# EAGLE design FanControl_1-0 (EAGLE 6.5.0)
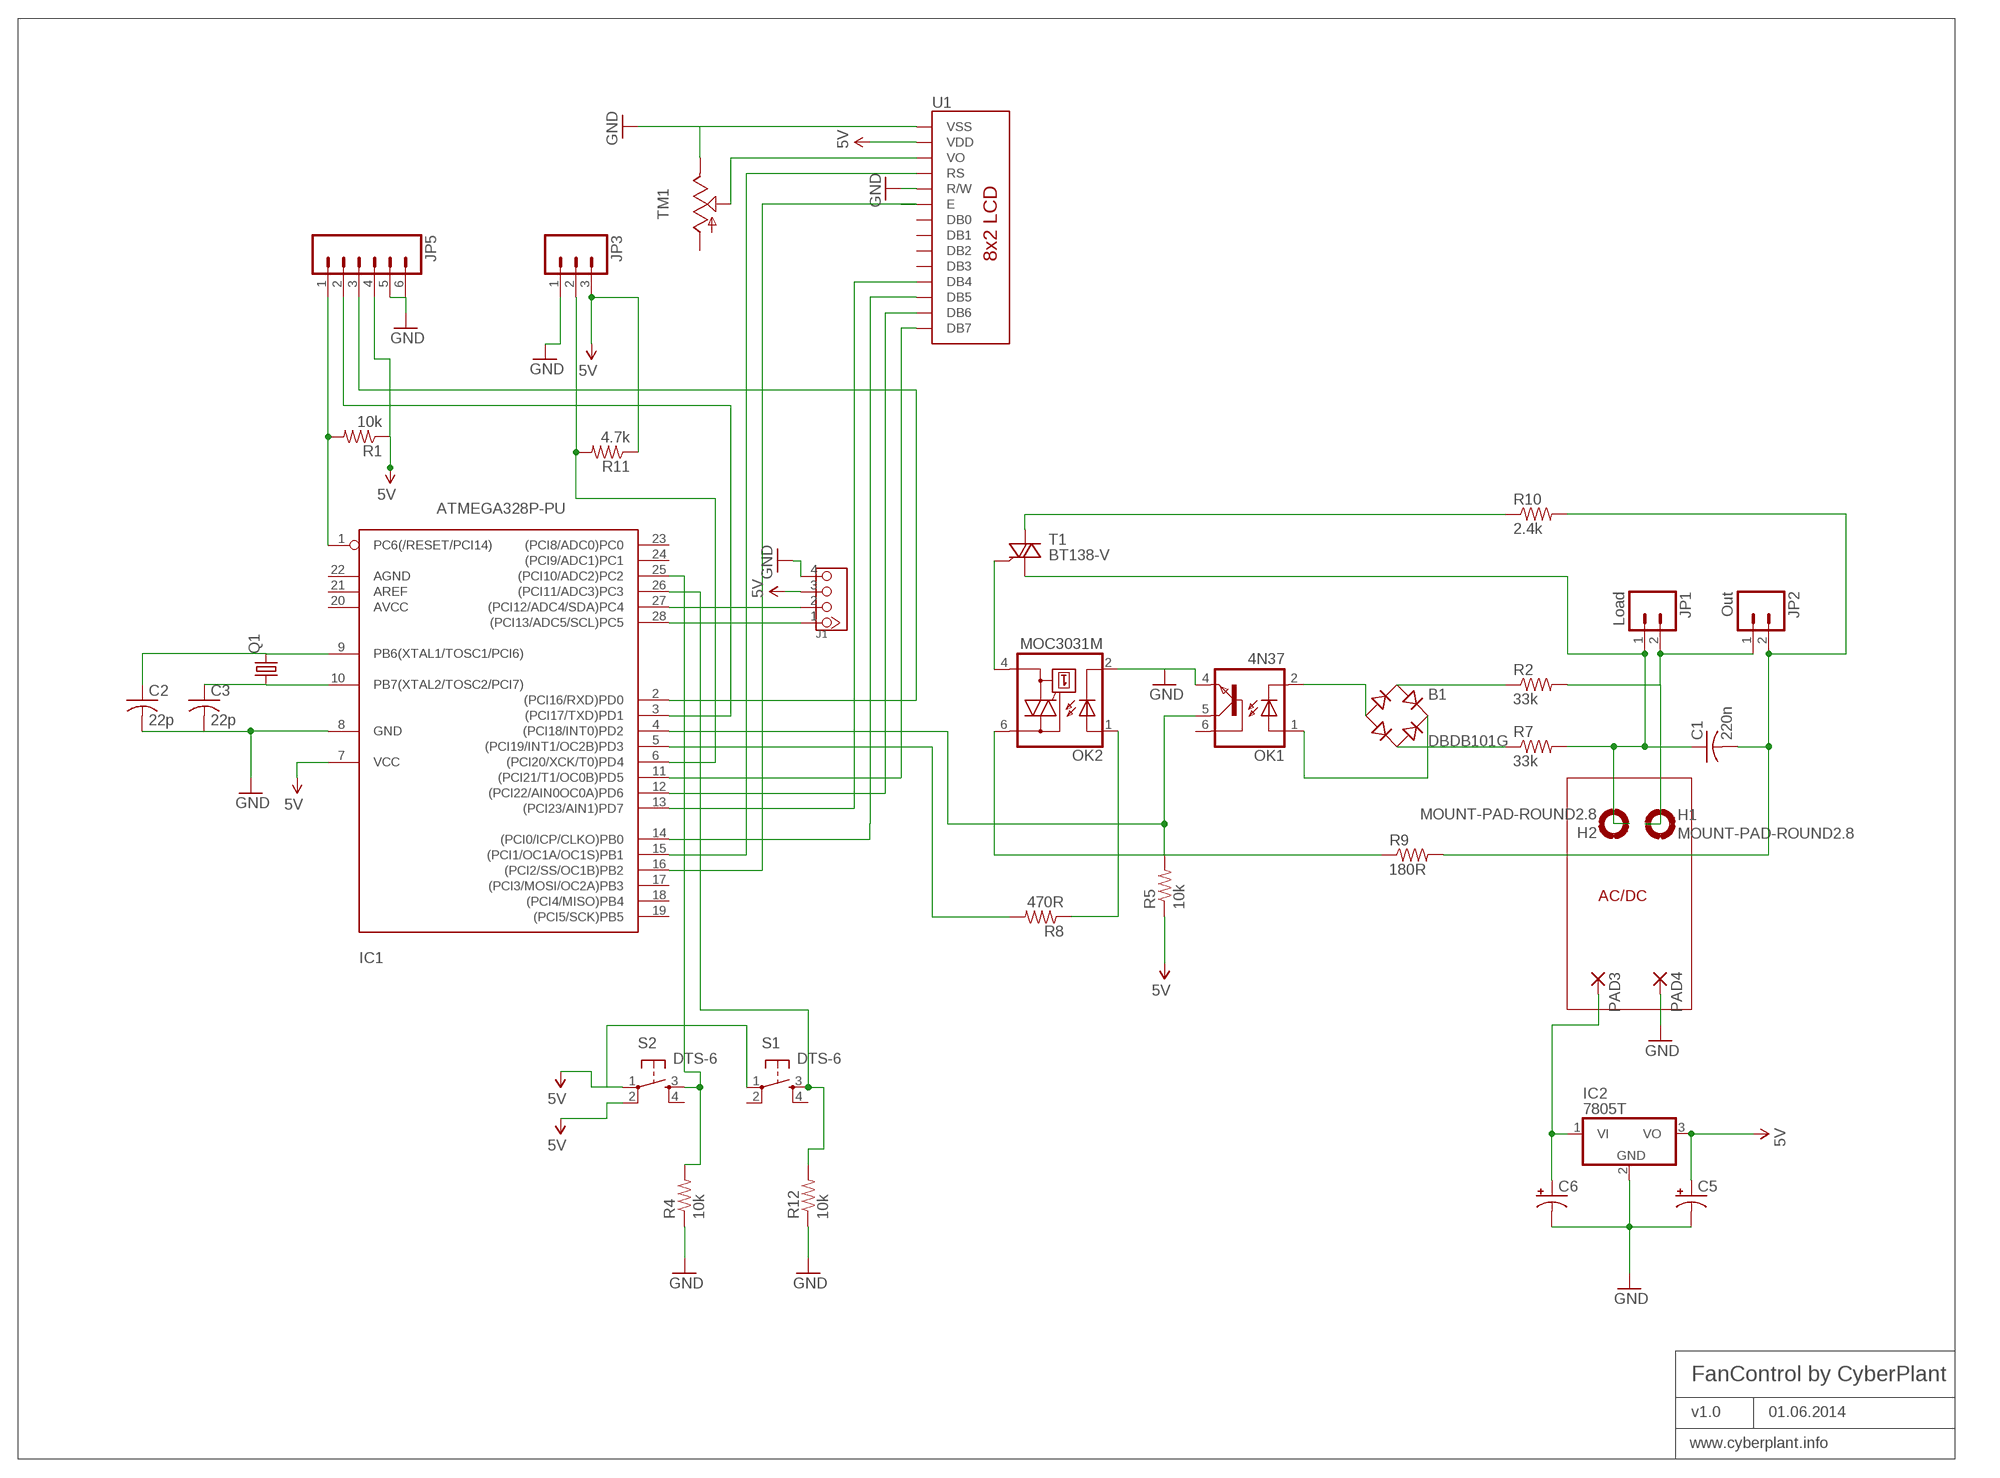
[diagram p0: schematic, sheet 1]

## Parts
B1  DBDB101G  [DB]
C1  220n  C-US150-064X183  [C150-064X183]
C2  22p  C-US050-025X075  [C050-025X075]
C3  22p  C-US050-025X075  [C050-025X075]
C5  CAP_POLPTH2  [CPOL-RADIAL-10UF-25V]
C6  CAP_POLPTH2  [CPOL-RADIAL-10UF-25V]
H1  MOUNT-PAD-ROUND2.8  [2,8-PAD]
H2  MOUNT-PAD-ROUND2.8  [2,8-PAD]
IC1  ATMEGA328P-PU  ATMEGA168-20P  [DIL28-3]
IC2  7805T  [TO220H]
J1  TWIG-4P-2.090D  [4P-2.0-90D]
JP1  Load  M025MM  [SCREWTERMINAL-5MM-2]
JP2  Out  M025MM  [SCREWTERMINAL-5MM-2]
JP3  M031X03_NO_SILK  [1X03_NO_SILK]
JP5  M06SIP  [1X06]
OK1  4N37  [DIL06]
OK2  MOC3031M  [DIL06]
PAD3  1,6/0,8  [1,6/0,8]
PAD4  1,6/0,8  [1,6/0,8]
Q1  CRYSTALHC49S  [HC49/S]
R1  10k  RESISTORPTH-1/6W  [1/6W-RES]
R2  33k  RESISTORPTH-1W  [AXIAL-0.6]
R4  10k  RESISTORPTH-1/6W  [1/6W-RES]
R5  10k  RESISTORPTH-1/6W  [1/6W-RES]
R7  33k  RESISTORPTH-1W  [AXIAL-0.6]
R8  470R  RESISTORPTH-1/4W  [AXIAL-0.4]
R9  180R  RESISTORPTH-2W  [AXIAL-0.8]
R10  2.4k  RESISTORPTH-2W  [AXIAL-0.8]
R11  4.7k  RESISTORPTH-1/4W  [AXIAL-0.4]
R12  10k  RESISTORPTH-1/6W  [1/6W-RES]
S1  DTS-6  [DTS-6]
S2  DTS-6  [DTS-6]
T1  BT138-V  [TO220BV]
TM1  TRIM  [6MM]
U1  LCD-8X2-WH0802A8X2  [LCD-8X2-WH0802A]

## Nets
5V: C5.1(+) IC1.7(VCC) IC2.3(VO) J1.3 JP3.3 JP5.4 R1.1 R5.1 R11.P$1 S1.1 S2.1 S2.2 U1.2(VDD)
GND: C2.2 C3.2 C5.2(-) C6.2(-) IC1.8(GND) IC2.2(GND) J1.4 JP3.1 JP5.5 JP5.6 OK1.4(EMI) OK2.2(C) PAD4.1(P) R4.1 R12.1 TM1.E U1.1(VSS) U1.5(R/W)
N$1: C1.1 H2.B2,8(MOUNT) JP1.1 R7.P$2 T1.T1(A1)
N$2: C1.2 JP2.2 R9.P$2 R10.P$2
N$3: H1.B2,8(MOUNT) JP1.2 JP2.1 R2.P$2
N$4: B1.AC1 R2.P$1
N$5: B1.AC2 R7.P$1
N$6: B1.- OK1.2(C)
N$7: B1.+ OK1.1(A)
N$8: IC1.4((PCI18/INT0)PD2) OK1.5(COL) R5.2
N$9: OK2.4(A1) T1.G
N$10: IC1.5((PCI19/INT1/OC2B)PD3) R8.P$2
N$11: OK2.1(A) R8.P$1
N$12: R10.P$1 T1.T2(A2)
N$13: OK2.6(A2) R9.P$1
N$14: C2.1 IC1.9(PB6(XTAL1/TOSC1/PCI6)) Q1.2
N$15: C3.1 IC1.10(PB7(XTAL2/TOSC2/PCI7)) Q1.1
N$16: IC1.6((PCI20/XCK/T0)PD4) JP3.2 R11.P$2
N$17: C6.1(+) IC2.1(VI) PAD3.1(P)
N$18: TM1.S U1.3(VO)
N$19: IC1.15((PCI1/OC1A/OC1S)PB1) U1.4(RS)
N$20: IC1.16((PCI2/SS/OC1B)PB2) U1.6(E)
N$21: IC1.13((PCI23/AIN1)PD7) U1.11(DB4)
N$22: IC1.14((PCI0/ICP/CLKO)PB0) U1.12(DB5)
N$23: IC1.12((PCI22/AIN0OC0A)PD6) U1.13(DB6)
N$24: IC1.11((PCI21/T1/OC0B)PD5) U1.14(DB7)
N$26: IC1.25((PCI10/ADC2)PC2) R4.2 S2.3
N$27: IC1.26((PCI11/ADC3)PC3) R12.2 S1.3
N$28: IC1.28((PCI13/ADC5/SCL)PC5) J1.1
N$29: IC1.1(PC6(/RESET/PCI14)) JP5.1 R1.2
N$30: IC1.27((PCI12/ADC4/SDA)PC4) J1.2
N$31: IC1.3((PCI17/TXD)PD1) JP5.2
N$32: IC1.2((PCI16/RXD)PD0) JP5.3
Unconnected: IC1.17((PCI3/MOSI/OC2A)PB3) IC1.18((PCI4/MISO)PB4) IC1.19((PCI5/SCK)PB5) IC1.20(AVCC) IC1.21(AREF) IC1.22(AGND) IC1.23((PCI8/ADC0)PC0) IC1.24((PCI9/ADC1)PC1) OK1.6(BAS) S1.2 S1.4 S2.4 TM1.A U1.7(DB0) U1.8(DB1) U1.9(DB2) U1.10(DB3)

## Notes on the sheet
- AC/DC
- FanControl by CyberPlant
- v1.0 | 01.06.2014
- www.cyberplant.info

## Library data of the parts
B1 = rectifier:DB?*G: Single Phase 1.0 AMP Glass Passivated Bridge Rectifier Taiwan Semiconductor Co.,Ltd. - TSC Source: http://www.taiwansemi.com/TSCbig5/ezcatfiles/cust/img/img/db101g.pdf http://www.ts.com.tw/db/pictures/modules/PDT/PDT060207001/DBLS201G.pdf
C1-C3 = adafruit:C-US: CAPACITOR, American symbol
C5 C6 = wh0802a2:CAP_POL: Capacitor Polarized These are standard SMD and PTH capacitors. Normally 10uF, 47uF, and 100uF in electrolytic and tantalum varieties. Always verify the external diameter of the through hole cap, it varies with capacity, voltage, and manufacturer. The EIA devices should be standard.
H1 H2 = holes:MOUNT-PAD-ROUND: MOUNTING PAD, round
IC1 = adafruit:ATMEGA168*P: MICROCONTROLLER 16 kBytes FLASH 1 kBytes SRAM 512 Bytes EEPROM USART 8-channel 10 bit ADC
IC2 = linear:78*: Positive VOLTAGE REGULATOR Source: http://cache.national.com/ds/LM/LM78L05.pdf http://www.fairchildsemi.com/ds/LM/LM7805.pdf
J1 = Connector:TWIG-4P-2.0
JP1 JP2 = SparkFun:M02: Header 2 Standard 2-pin 0.1" header. Use with straight break away headers (SKU : PRT-00116), right angle break away headers (PRT-00553), swiss pins (PRT-00743), machine pins (PRT-00117), and female headers (PRT-00115). Molex polarized connector foot print use with SKU : PRT-08233 with associated crimp pins and housings.
JP3 = SparkFun:M03: Header 3 Standard 3-pin 0.1" header. Use with straight break away headers (SKU : PRT-00116), right angle break away headers (PRT-00553), swiss pins (PRT-00743), machine pins (PRT-00117), and female headers (PRT-00115). Molex polarized connector foot print use with SKU : PRT-08232 with associated crimp pins and housings.
JP5 = SparkFun:M06: Header 6 Standard 6-pin 0.1" header. Use with straight break away headers (SKU : PRT-00116), right angle break away headers (PRT-00553), swiss pins (PRT-00743), machine pins (PRT-00117), and female headers (PRT-00115). Molex polarized connector foot print use with SKU : PRT-08094 with associated crimp pins and housings. NOTES ON THE VARIANTS LOCK and LOCK_LONGPADS... This footprint was designed to help hold the alignment of a through-hole component (i.e. 6-pin header) while soldering it into place. You may notice that each hole has been shifted either up or down by 0.005 of an inch from it's more standard position (which is a perfectly straight line). This slight alteration caused the pins (the squares in the middle) to touch the edges of the holes. Because they are alternating, it causes a "brace" to hold the component in place. 0.005 has proven to be the perfect amount of "off-center" position when using our standard breakaway headers. Although looks a little odd when you look at the bare footprint, once you have a header in there, the alteration is very hard to notice. Also, if you push a header all the way into place, it is covered up entirely on the bottom side. This idea of altering the position of holes to aid alignment will be further integrated into the Sparkfun Library for other footprints. It can help hold any component with 3 or more connection pins.
OK1 = optocoupler:4N37: OPTO COUPLER Source: http://www.fairchildsemi.com/pf/4N/4N35-M.html; MF: FAIRCHILD SEMICONDUCTOR; MPN: 4N37; OC_FARNELL: 1612456; OC_NEWARK: 72K9948
OK2 = optocoupler:MOC30*: 6-Pin DIP Zero-Cross Optoisolators Triac Driver Output (250/400 Volt Peak) Source: Data sheet <http://www.fairchildsemi.com/ds/MO/MOC3031M.pdf> The old path of data sheet not more available 2013-05-06.; MF: FAIRCHILD SEMICONDUCTOR; MPN: MOC3031M; OC_FARNELL: 9875964; OC_NEWARK: 78K6089
PAD3 PAD4 = wirepad:1,6/0,8: THROUGH-HOLE PAD
Q1 = adafruit:CRYSTAL: CRYSTAL; OC_FARNELL: 1667008; OC_NEWARK: unknown
R1 R2 R4 R5 R7-R12 = SparkFun:RESISTOR: Resistor Basic schematic elements and footprints for 0603, 1206, and PTH resistors.
S1 S2 = switch-tact:DTS-6
T1 = triac:BT138: TRIAC Source: http://www.semiconductors.philips.com BT138_SERIES_2.pdf
TM1 = adafruit:TRIM
U1 = wh0802a2:LCD-8X2-WH0802A

## Board
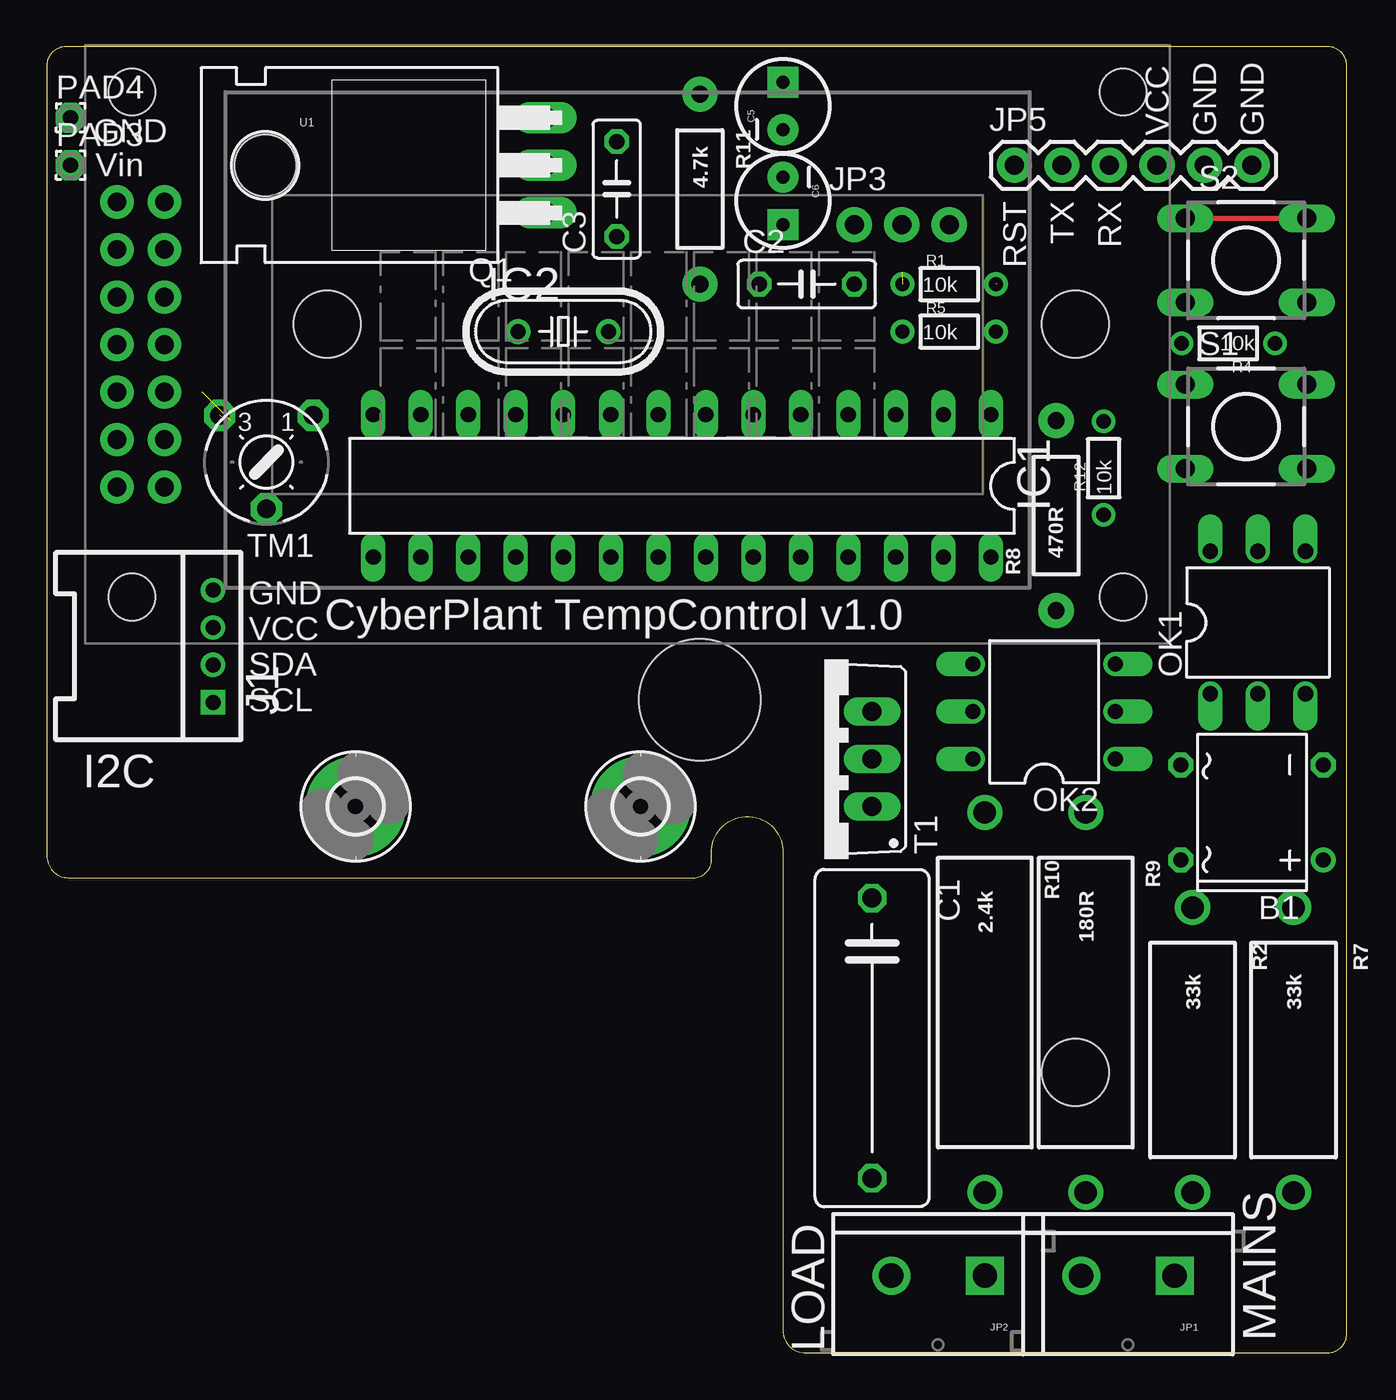
[diagram p1: board, top side]
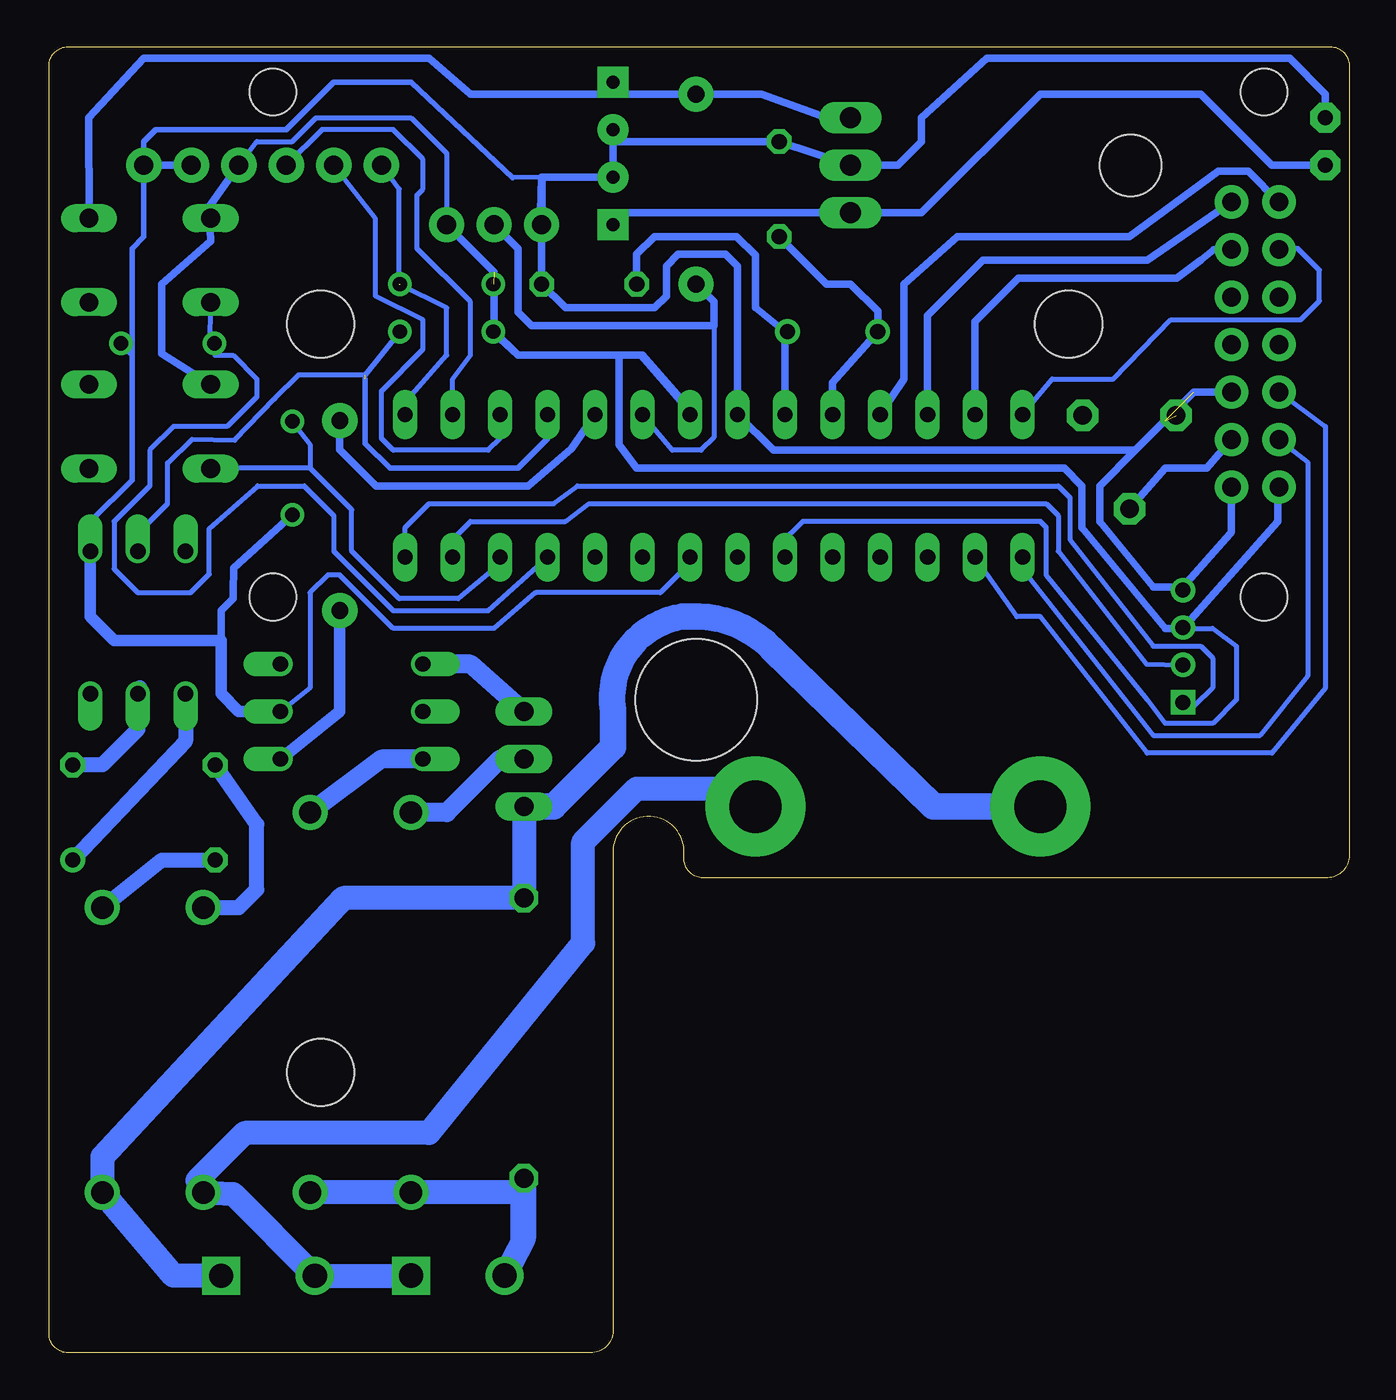
[diagram p2: board, bottom side, seen from below]

Size 69.52 x 69.84 mm. Coordinates in mm from the lower left corner, seen from the top.
Outline: 1.27,25.4 34.56,25.4 arc90 35.56,26.4 35.56,26.67 arc-186 39.37,26.67 39.37,1.27 arc90 40.46,0 68.52,0 arc90 69.52,1 69.52,68.84 arc90 68.52,69.84 1,69.84 arc90 0,68.84 0,26.49 arc90 1.27,25.4
Copper layers (1*16): Top 0.035mm / dielectric 1.5mm / Bottom 0.035mm
Design rules "default": minimum track width 10mil, minimum drill 24mil, track to track 8mil, track to pad 8mil, pad to pad 8mil, via to via 8mil, smd to smd 8mil, copper to edge 40mil, drill to drill 8mil, minimum pad ring 10mil, minimum via ring 8mil, stop-mask expansion 4mil, vias tented up to drill 0mil, thermal gap 10mil
Holes 6.5 mm at 34.92,34.92
Holes 3.6 mm at 15,55 55,15 55,55

### Footprints (pad centres in the part's own frame; a part is rotated, then mirrored left to right if it is on the bottom)
DB = drill 0.813: + -2.54,-3.81 | drill 0.813 octagon: - 2.54,-3.81; AC1 2.54,3.81; AC2 -2.54,3.81
C150-064X183 = drill 1.016 octagon: 1 -7.493,0; 2 7.493,0
C050-025X075 = drill 0.813 octagon: 1 -2.54,0; 2 2.54,0
CPOL-RADIAL-10UF-25V = drill 0.7 pad 1.651 square: 1 1.27,0 | drill 0.7 pad 1.651: 2 -1.27,0
2,8-PAD = drill 2.8 pad 5.334: B2,8 0,0
DIL28-3 = drill 0.813 long: 1 -16.51,-3.81; 2 -13.97,-3.81; 3 -11.43,-3.81; 4 -8.89,-3.81; 5 -6.35,-3.81; 6 -3.81,-3.81; 7 -1.27,-3.81; 8 1.27,-3.81; 9 3.81,-3.81; 10 6.35,-3.81; 11 8.89,-3.81; 12 11.43,-3.81; 13 13.97,-3.81; 14 16.51,-3.81; 15 16.51,3.81; 16 13.97,3.81; 17 11.43,3.81; 18 8.89,3.81; 19 6.35,3.81; 20 3.81,3.81; 21 1.27,3.81; 22 -1.27,3.81; 23 -3.81,3.81; 24 -6.35,3.81; 25 -8.89,3.81; 26 -11.43,3.81; 27 -13.97,3.81; 28 -16.51,3.81
TO220H = drill 1.118 long: 1 -2.54,-10.16; 2 0,-10.16; 3 2.54,-10.16 | hole 3.302: 0,4.826
4P-2.0-90D = drill 0.8 pad 1.27 square: 1 -3,0 | drill 0.8 pad 1.27: 2 -1,0; 3 1,0; 4 3,0
SCREWTERMINAL-5MM-2 = drill 1.3 pad 2.032 square: 1 0,0 | drill 1.3 pad 2.032: 2 5,0
1X03_NO_SILK = drill 1.016 pad 1.88: 1 0,0; 2 2.54,0; 3 5.08,0
1X06 = drill 1.016 pad 1.88: 1 0,0; 2 2.54,0; 3 5.08,0; 4 7.62,0; 5 10.16,0; 6 12.7,0
DIL06 = drill 0.813 offset: 1 -2.54,-3.81; 2 0,-3.81; 3 2.54,-3.81; 4 2.54,3.81; 5 0,3.81; 6 -2.54,3.81
1,6/0,8 = drill 0.813 pad 1.6 octagon: 1 0,0
HC49/S = drill 0.813: 1 -2.413,0; 2 2.413,0
1/6W-RES = drill 0.762: 1 -2.5,0; 2 2.5,0
AXIAL-0.6 = drill 1.2 pad 1.88: P$1 -7.62,0; P$2 7.62,0
AXIAL-0.4 = drill 0.9 pad 1.88: P$1 -5.08,0; P$2 5.08,0
AXIAL-0.8 = drill 1.2 pad 1.88: P$1 -10.16,0; P$2 10.16,0
DTS-6 = drill 1 long: 1 -3.25,2.25; 2 3.25,2.25; 3 -3.25,-2.25; 4 3.25,-2.25
TO220BV = drill 1.016 long: G 2.54,-2.54; T1 -2.54,-2.54; T2 0,-2.54
6MM = drill 1 pad 1.676 octagon: A -2.5,-2.5; E 2.5,-2.5; S 0,2.5
LCD-8X2-WH0802A = drill 1 pad 1.778: 1 -26.26,-9.12; 2 -28.8,-9.12; 3 -26.26,-6.58; 4 -28.8,-6.58; 5 -26.26,-4.04; 6 -28.8,-4.04; 7 -26.26,-1.5; 8 -28.8,-1.5; 9 -26.26,1.04; 10 -28.8,1.04; 11 -26.26,3.58; 12 -28.8,3.58; 13 -26.26,6.12; 14 -28.8,6.12 | hole 2.5: 25,-15; 25,12; -28,12; -28,-15

### Placement (x,y rotation side)
B1  64.45,28.89 90 top
C1  44.13,16.83 270 top
C2  40.64,57.15 0 top
C3  30.48,62.23 90 top
C5  39.37,66.67 90 top
C6  39.37,61.59 270 top
H1  31.75,29.21 0 top
H2  16.51,29.21 0 top
IC1  33.97,46.35 180 top
IC2  16.51,63.5 90 top
J1  8.89,37.78 90 top
JP1  60.31,4.12 180 top
JP2  50.16,4.13 180 top
JP3  43.18,60.33 0 top
JP5  51.75,63.5 0 top
OK1  64.77,39.05 0 top
OK2  53.34,34.29 90 top
PAD3  1.27,63.5 0 top
PAD4  1.27,66.04 0 top
Q1  27.62,54.61 0 top
R1  48.26,57.15 0 top
R2  61.28,16.19 270 top
R4  63.18,53.98 180 top
R5  48.26,54.61 0 top
R7  66.67,16.19 270 top
R8  53.98,44.77 90 top
R9  55.56,18.73 270 top
R10  50.16,18.73 270 top
R11  34.92,62.23 270 top
R12  56.52,47.31 90 top
S1  64.14,49.53 0 top
S2  64.14,58.42 0 top
T1  41.59,31.75 90 top
TM1  11.75,47.62 180 top
U1  32.55,55.41 0 top

### Tracks (layer width: path | path; a pad name or v marks a point on that pad's centre or on a via)
5V  (1 unrouted)
  Top 0.254: S2.1 S2.2
  Bottom 0.254: 35.56,50.8 IC1.7 | 3.81,45.72 U1.2 | 44.45,53.34 R5.1 | J1.3 8.89,38.73 | JP3.3 48.26,64.14 50.16,66.04 55.24,66.04 56.52,64.77 58.42,64.77 JP5.4 60.88,61.35 S2.1 60.88,59.45
  Bottom 0.406: R11.P$1 31.43,67.31 27.94,66.04 IC2.3 | 45.72,54.61 44.45,53.34 | JP3.3 45.72,57.78 45.72,54.61 | 35.56,50.8 37.78,53.34 37.88,53.34 | R11.P$1 46.99,67.31 49.21,69.22 64.45,69.22 67.41,66.04 S2.2 | 39.05,53.34 37.88,53.34 | 37.88,53.34 35.56,50.7 IC1.7 | 45.72,54.61 45.72,54.52 44.45,53.34 | 44.45,53.34 39.05,53.34 | 39.05,53.34 39.05,48.58 38.1,47.31 15.24,47.31 14.29,46.35 14.29,44.13 9.84,38.73 8.89,38.73 3.81,44.45 3.81,45.72 | R11.P$1 39.37,67.31 C5.1 | JP5.4 60.96,61.28 60.88,59.45 63.5,57.15 63.5,53.44 S1.1
GND  (2 unrouted)
  Bottom 0.254: J1.4 8.89,40.96 | 43.27,60.33 43.27,60.1 | 43.18,62.87 43.14,62.87 44.73,62.83 | R4.1 65.09,53.34 | 65.09,46.67 67.31,44.45 | 35.56,41.91 36.83,40.64 43.5,40.64 45.72,38.73 51.12,38.73 53.98,41.59 54.61,41.59 55.56,40.64 55.56,35.56 OK2.2
  Bottom 0.305: 65.09,46.67 65.09,53.34 65.09,59.05 64.45,59.69 JP5.6 64.45,64.77 63.82,65.41 56.83,65.41 54.29,67.94 50.16,67.94 44.73,62.83
  Bottom 0.406: 11.43,48.26 30.8,48.26 IC1.8 32.7,58.1 33.34,58.74 35.88,58.74 36.51,58.1 36.51,56.52 37.15,55.88 41.91,55.88 C2.2 JP3.1 | U1.1 6.29,43.88 6.35,43.81 8.89,40.96 10.48,40.96 13.34,44.45 13.34,46.35 11.43,48.26 | 11.43,48.26 8.31,51.38 U1.5 | 43.18,61.05 43.17,61.12 | 43.17,61.12 43.27,60.33 JP3.1 | 43.17,62.87 43.17,61.12 | C5.2 39.37,64.77 | PAD4.1 1.27,67.31 3.17,69.22 19.37,69.22 22.86,66.04 22.86,64.77 24.13,63.5 IC2.2 C3.2 39.37,64.77 | JP3.1 43.17,62.87 | 43.17,62.87 43.14,62.87 C6.2 39.37,64.77 | 43.27,60.1 43.18,62.87 | 67.31,44.45 OK1.4 | R12.1 59.65,41.95 59.69,40.64 59.69,40.32 60.33,39.69 60.33,38.1 | JP5.5 JP5.6
  Bottom 0.61: OK2.2 59.37,34.29 60.33,35.24 60.33,38.1 66.04,38.1 67.31,39.37 OK1.4
N$1
  Bottom 1.016: 60.33,4.42 JP1.1
  Bottom 1.27: T1.T1 C1.1 53.78,24.32 66.67,10.48 R7.P$2 62.88,4.12 JP1.1
  Bottom 1.422: H2.B2,8 22.23,29.21 30.89,37.66 arc-49 35.29,39.37 35.64,39.37 arc-90 39.37,34.37 39.37,32.38 42.55,29.21 T1.T1
N$2
  Bottom 1.016: JP2.2 44.21,6.11
  Bottom 1.27: C1.2 44.13,6.11 JP2.2 | 44.21,6.11 44.21,8.49 44.13,8.57 R10.P$2 R9.P$2
N$3
  Bottom 1.016: 50.17,4.12 JP2.1
  Bottom 1.27: H1.B2,8 32.7,30.16 38.1,30.16 40.96,27.3 40.96,21.91 49.21,11.75 59.05,11.75 61.59,9.21 R2.P$2 59.69,8.49 JP1.2 50.17,4.12
N$4
  Bottom 0.813: R2.P$1 59.37,23.81 58.42,24.77 58.42,28.26 B1.AC1
N$5
  Bottom 0.813: B1.AC2 63.5,26.35 R7.P$1
N$6
  Bottom 0.813: OK1.2 64.77,35.34 64.67,35.56 64.67,33.75 64.77,33.66 64.77,33.34 66.67,31.43 B1.-
N$7
  Bottom 0.813: B1.+ 62.23,32.7 OK1.1
N$8  (1 unrouted)
  Bottom 0.254: 64.77,43.81 63.18,45.4 63.18,47.59 61.88,48.86 59.59,48.8 57.46,51.01 56.18,52.29 52.61,52.29
  Bottom 0.305: R5.2 52.61,52.29 | 52.61,52.07 52.61,48.62 51.29,47.31 44.45,47.31 42.86,48.9 IC1.4
  Bottom 0.406: OK1.5 64.77,43.81
N$9
  Bottom 1.016: T1.G 46.99,36.83 OK2.4
N$10
  Bottom 0.406: R8.P$2 53.98,48.31 52.02,46.35 43.91,46.35 41.59,48.35 IC1.5
N$11
  Bottom 0.61: OK2.1 53.98,34.29 R8.P$1
N$12
  Bottom 1.016: T1.T2 45.4,31.75 48.26,28.89 R10.P$1
N$13
  Bottom 1.016: OK2.6 51.75,31.75 R9.P$1
N$14
  Bottom 0.254: 30.16,54.61 Q1.2
  Bottom 0.406: C2.1 38.1,58.74 37.15,59.69 32.75,59.69 31.75,58.69 31.75,55.88 30.16,54.61 IC1.9
N$15
  Bottom 0.406: IC1.10 27.62,50.8 27.62,51.88 Q1.1 25.21,55.69 26.67,57.15 27.94,57.15 C3.1
N$16
  Bottom 0.254: IC1.6 36.2,48.26 34.66,48.26 33.97,48.94 33.97,54.93
  Bottom 0.406: JP3.2 44.45,59.05 44.45,55.66 43.72,54.93 33.97,54.93 33.97,56.2 R11.P$2
N$17
  Bottom 0.406: C6.1 38.73,60.96 IC2.1 22.86,60.96 16.51,67.31 7.94,67.31 4.13,63.5 PAD3.1
N$18
  Bottom 0.406: TM1.S 9.84,47.31 7.62,47.31 U1.3
N$19
  Bottom 0.254: 3.81,48.9 U1.4 2.22,47.62 2.22,36.2 4.76,33.02 10.48,33.02 17.46,41.91
  Bottom 0.305: IC1.15 17.46,41.91
N$20
  Bottom 0.254: U1.6 3.81,51.44 1.27,49.53 1.27,35.56 4.13,32.07 10.79,32.07 16.51,39.37 17.78,39.37 IC1.16
N$21
  Bottom 0.406: IC1.13 20,55.15 17.68,57.47 9.21,57.47 7.94,58.42 7.24,58.99 U1.11
N$22
  Bottom 0.254: IC1.14 15.88,52.07 12.61,52.07 9.53,55.24 2.59,55.24 1.59,56.24 1.59,57.91 2.74,59.05 2.86,59.05 U1.12
N$23
  Bottom 0.406: IC1.12 22.54,55.47 19.59,58.42 10.79,58.42 U1.13
N$24
  Bottom 0.406: IC1.11 23.81,52.07 23.81,57.15 20.95,59.69 11.75,59.69 6.99,63.18 5.4,63.18 U1.14
N$26
  Bottom 0.254: S2.3 60.93,54.58 60.93,53.69 60.64,53.34 | 60.64,53.34 59.69,53.34 58.42,52.07 58.42,51.12 60.01,49.53 62.87,49.53 64.14,48.26 64.14,46.35 66.04,44.45 66.04,41.91 64.77,40.64 61.96,40.64 60.96,41.64 60.96,44.09 58.37,46.35 55.88,46.35 54.29,44.77 54.29,42.86 51.12,39.69 46.04,39.69 IC1.25 | R4.2 60.64,53.34
N$27
  Bottom 0.254: 45.72,41.91 47.62,40.32 50.8,40.32 53.34,42.86 53.34,45.09 55.56,47.31 | 55.56,47.31 60.86,47.31 | R12.2 55.56,48.58 55.56,47.31
  Bottom 0.406: IC1.26 45.72,41.91 | 60.86,47.31 S1.3
N$28
  Bottom 0.254: IC1.28 50.48,44.13 49.21,45.4 42.55,45.4 41.27,46.35 15.56,46.35 14.92,45.72 14.92,43.5 10.48,37.78 7.94,37.78 7.3,37.15 7.3,35.56 8.26,34.61 J1.1
N$29  (1 unrouted)
  Bottom 0.254: IC1.1 50.48,50.8 48.26,53.34 48.26,55.88 50.8,57.15 50.8,62.23 JP5.1
N$30
  Bottom 0.254: IC1.27 47.94,43.5 46.99,44.45 41.91,44.45 40.64,45.4 16.19,45.4 15.56,44.77 15.56,42.86 10.84,36.83 J1.2
N$31
  Bottom 0.254: IC1.3 45.4,48.9 46.04,48.26 51.12,48.26 51.75,48.9 51.75,51.44 49.53,53.66 49.53,55.24 52.07,56.52 52.07,60.64 JP5.2
N$32
  Bottom 0.254: IC1.2 47.94,52.07 46.99,53.34 46.99,56.2 49.85,59.05 49.85,61.91 49.53,62.23 49.53,63.82 51.12,65.41 54.93,65.41 JP5.3
N$33
  Bottom 0.254: 8.89,38.73 7.3,38.73 6.03,37.78 6.03,34.92 7.3,33.66 9.84,33.66 10.79,34.92 16.19,41.59 16.19,44.13 16.51,44.45 29.21,44.45 30.48,43.18

### Text on the board
tPlace: GND | VCC | GND | GND | Vin | RST | TX | RX | GND | VCC | CyberPlant TempControl v1.0 | SDA | SCL | I2C | MAINS | LOAD